# EAGLE board Linux_board.va (EAGLE 5.11)
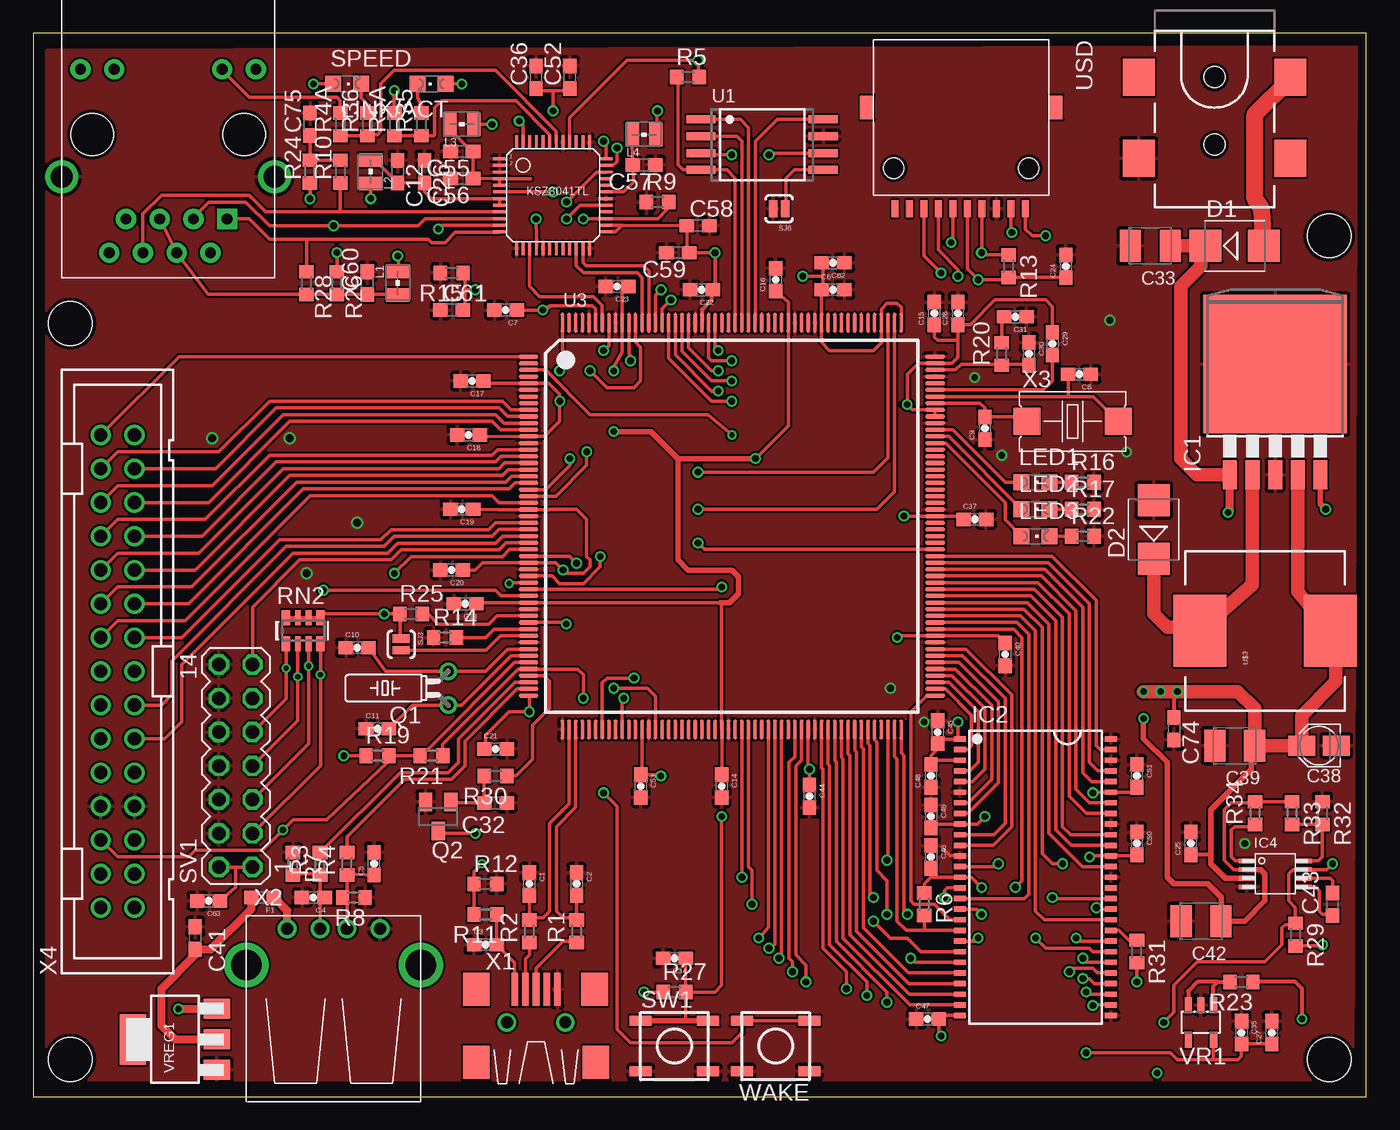
[diagram p3: board, top side]
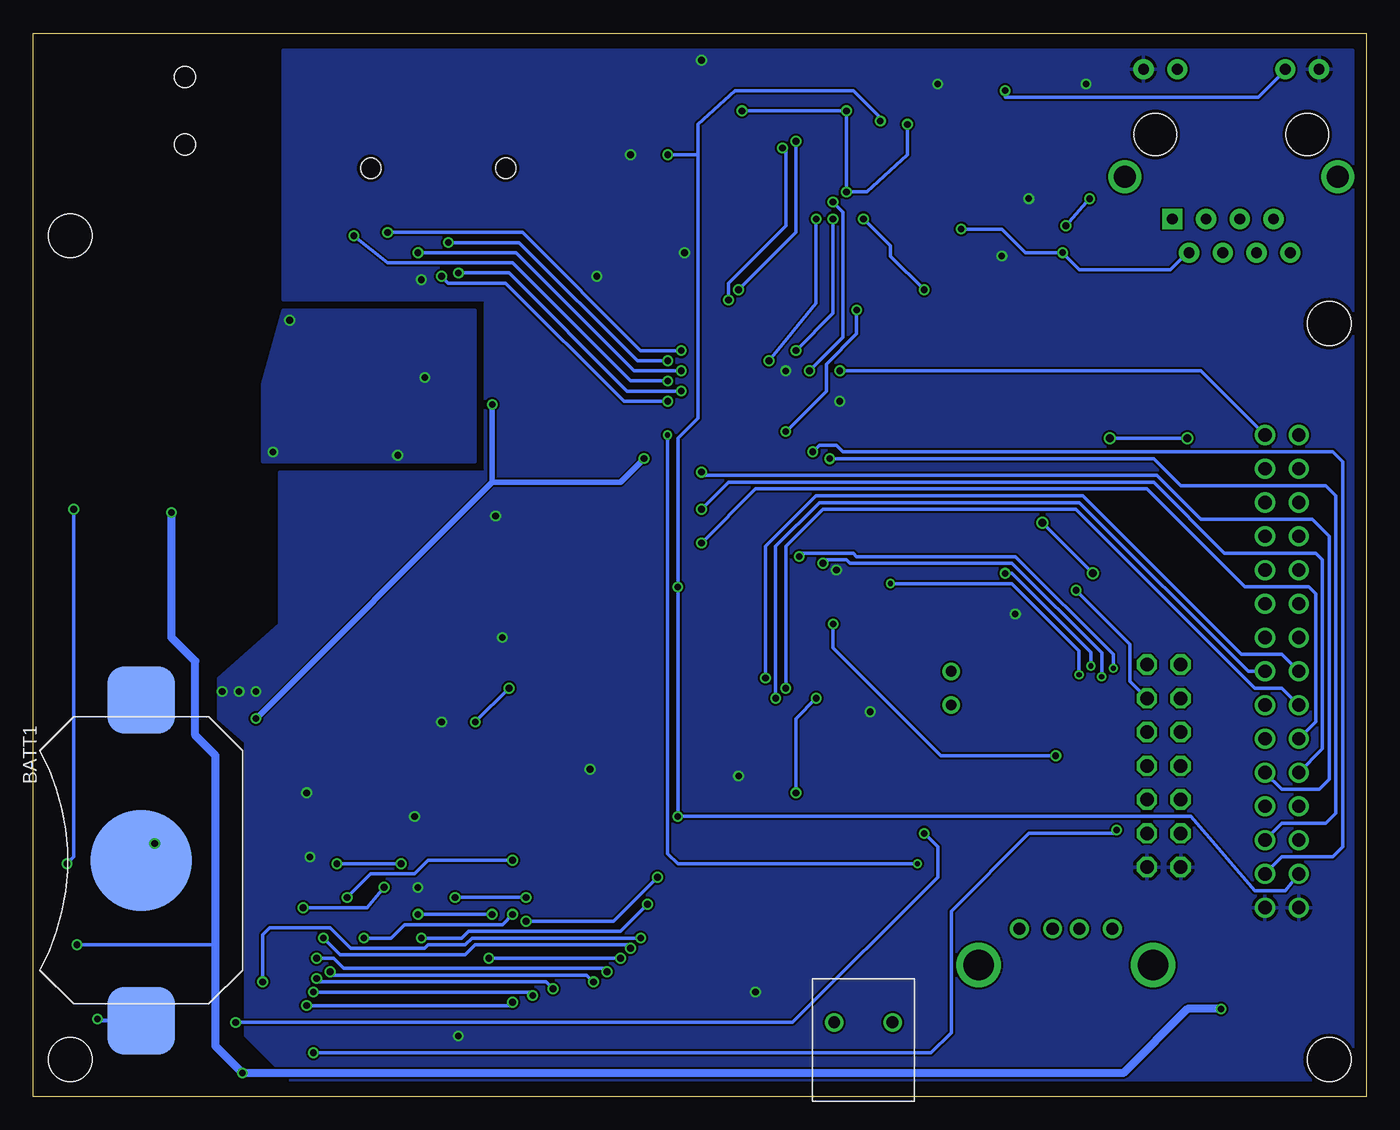
[diagram p4: board, bottom side, seen from below]

Size 100.33 x 80.01 mm. Coordinates in mm from the lower left corner, seen from the top.
Outline: 0,0 100.33,0 100.33,80.01 0,80.01 0,0
Copper layers (1*16): Top 0.035mm / dielectric 1.5mm / Bottom 0.035mm
Design rules "Fusion_eagle_rule_v1.1": minimum track width 6mil, minimum drill 12mil, track to track 6mil, track to pad 6mil, pad to pad 6mil, via to via 6mil, smd to smd 0mil, copper to edge 10mil, drill to drill 10mil, minimum pad ring 10mil, minimum via ring 6mil, stop-mask expansion 2mil, vias tented up to drill 100mil, thermal gap 10mil

## Footprints (pad centres in the part's own frame; a part is rotated, then mirrored left to right if it is on the bottom)
2032 = smd 5.08 x 5.08: V1 -12.065,0; V2 12.065,0 | smd 7.62 x 7.62: V- 0,0
0603-CAP = smd 1.1 x 1: 1 -0.85,0; 2 0.85,0
C0603 = smd 1.1 x 1: 1 -0.85,0; 2 0.85,0
C603 = smd 1.1 x 1: 1 -0.85,0; 2 0.85,0
SMC_B = smd 1.6 x 2.4: + -1.5,0; - 1.5,0
CASE_A = smd 2 x 1.5: + 1.3,0; - -1.3,0
SMB = smd 2.4 x 2.4: A 2.2,0; C -2.2,0
0603 = smd 1.1 x 1: 1 -0.85,0; 2 0.85,0
TO263-5 = smd 1.067 x 2.159: 1 -3.404,-5.791; 2 -1.702,-5.791; 3 0,-5.791; 4 1.702,-5.791; 5 3.404,-5.791 | smd 10.8 x 10.41: 6 0,2.54
TSOP54-400 = smd 0.4 x 0.9: 1 -10.4,-5.68; 2 -9.6,-5.68; 3 -8.8,-5.68; 4 -8,-5.68; 5 -7.2,-5.68; 6 -6.4,-5.68; 7 -5.6,-5.68; 8 -4.8,-5.68; 9 -4,-5.68; 10 -3.2,-5.68; 11 -2.4,-5.68; 12 -1.6,-5.68; 13 -0.8,-5.68; 14 0,-5.68; 15 0.8,-5.68; 16 1.6,-5.68; 17 2.4,-5.68; 18 3.2,-5.68; 19 4,-5.68; 20 4.8,-5.68; 21 5.6,-5.68; 22 6.4,-5.68; 23 7.2,-5.68; 24 8,-5.68; 25 8.8,-5.68; 26 9.6,-5.68; 27 10.4,-5.68; 28 10.4,5.68; 29 9.6,5.68; 30 8.8,5.68; 31 8,5.68; 32 7.2,5.68; 33 6.4,5.68; 34 5.6,5.68; 35 4.8,5.68; 36 4,5.68; 37 3.2,5.68; 38 2.4,5.68; 39 1.6,5.68; 40 0.8,5.68; 41 0,5.68; 42 -0.8,5.68; 43 -1.6,5.68; 44 -2.4,5.68; 45 -3.2,5.68; 46 -4,5.68; 47 -4.8,5.68; 48 -5.6,5.68; 49 -6.4,5.68; 50 -7.2,5.68; 51 -8,5.68; 52 -8.8,5.68; 53 -9.6,5.68; 54 -10.4,5.68
MSOP8 = smd 1.2 x 0.35: 1 -2.145,0.975; 2 -2.145,0.325; 3 -2.145,-0.325; 4 -2.145,-0.975; 5 2.145,-0.975; 6 2.145,-0.325; 7 2.145,0.325; 8 2.145,0.975
HR911105A = drill 0.813 pad 1.524 square: 1 4.445,-6.35 | drill 0.813 pad 1.524 round: 2 3.175,-8.89; 3 1.905,-6.35; 4 0.635,-8.89; 5 -0.635,-6.35; 6 -1.905,-8.89; 7 -3.175,-6.35; 8 -4.445,-8.89; 9 6.604,4.902; 10 4.064,4.902; 11 -4.064,4.902; 12 -6.604,4.902 | drill 1.651 pad 2.159 round: 13 8.001,-3.175; 14 -8.001,-3.175 | hole 3.2: 5.715,0; -5.715,0
STAND-OFF = hole 3.302: 0,0
WE-KI_0805_B = smd 1.02 x 1.78: 1 -0.89,0; 2 0.89,0
CHIPLED_0805 = smd 1.2 x 1.2: A 0,-1.05; C 0,1.05
TC26H = drill 0.813 round: 1 -1.27,0; 2 1.27,0
SOT23 = smd 1 x 1.4: 1 -0.95,-1.1; 2 0.95,-1.1; 3 0,1.1
R0603 = smd 1 x 1.1: 1 -0.85,0; 2 0.85,0
RN8P-4R-CRA06S = smd 0.63 x 1.15: 1 -1.295,-0.975; 4 1.295,-0.975; 5 1.295,0.975; 8 -1.295,0.975 | smd 0.44 x 1.15: 2 -0.4,-0.975; 3 0.4,-0.975; 6 0.4,0.975; 7 -0.4,0.975
SJ_2S-NO = smd 0.635 x 1.27: 1 -0.45,0; 2 0.45,0
MA07-2 = drill 1.016 octagon: 1 -7.62,-1.27; 2 -7.62,1.27; 3 -5.08,-1.27; 4 -5.08,1.27; 5 -2.54,-1.27; 6 -2.54,1.27; 7 0,-1.27; 8 0,1.27; 9 2.54,-1.27; 10 2.54,1.27; 11 5.08,-1.27; 12 5.08,1.27; 13 7.62,-1.27; 14 7.62,1.27
TACT_SWITCH_SMALL = smd 1.651 x 0.762: 1 -2.54,1.905; 2 2.54,1.905; 3 -2.54,-1.905; 4 2.54,-1.905
SO08W = smd 0.6 x 2.2: 1 -1.905,-4.6; 2 -0.635,-4.6; 3 0.635,-4.6; 4 1.905,-4.6; 5 1.905,4.6; 6 0.635,4.6; 7 -0.635,4.6; 8 -1.905,4.6
PQFP208 = smd 1.5 x 0.32: 1 -15.3,12.75; 2 -15.3,12.25; 3 -15.3,11.75; 4 -15.3,11.25; 5 -15.3,10.75; 6 -15.3,10.25; 7 -15.3,9.75; 8 -15.3,9.25; 9 -15.3,8.75; 10 -15.3,8.25; 11 -15.3,7.75; 12 -15.3,7.25; 13 -15.3,6.75; 14 -15.3,6.25; 15 -15.3,5.75; 16 -15.3,5.25; 17 -15.3,4.75; 18 -15.3,4.25; 19 -15.3,3.75; 20 -15.3,3.25; 21 -15.3,2.75; 22 -15.3,2.25; 23 -15.3,1.75; 24 -15.3,1.25; 25 -15.3,0.75; 26 -15.3,0.25; 27 -15.3,-0.25; 28 -15.3,-0.75; 29 -15.3,-1.25; 30 -15.3,-1.75; 31 -15.3,-2.25; 32 -15.3,-2.75; 33 -15.3,-3.25; 34 -15.3,-3.75; 35 -15.3,-4.25; 36 -15.3,-4.75; 37 -15.3,-5.25; 38 -15.3,-5.75; 39 -15.3,-6.25; 40 -15.3,-6.75; 41 -15.3,-7.25; 42 -15.3,-7.75; 43 -15.3,-8.25; 44 -15.3,-8.75; 45 -15.3,-9.25; 46 -15.3,-9.75; 47 -15.3,-10.25; 48 -15.3,-10.75; 49 -15.3,-11.25; 50 -15.3,-11.75; 51 -15.3,-12.25; 52 -15.3,-12.75; 105 15.3,-12.75; 106 15.3,-12.25; 107 15.3,-11.75; 108 15.3,-11.25; 109 15.3,-10.75; 110 15.3,-10.25; 111 15.3,-9.75; 112 15.3,-9.25; 113 15.3,-8.75; 114 15.3,-8.25; 115 15.3,-7.75; 116 15.3,-7.25; 117 15.3,-6.75; 118 15.3,-6.25; 119 15.3,-5.75; 120 15.3,-5.25; 121 15.3,-4.75; 122 15.3,-4.25; 123 15.3,-3.75; 124 15.3,-3.25; 125 15.3,-2.75; 126 15.3,-2.25; 127 15.3,-1.75; 128 15.3,-1.25; 129 15.3,-0.75; 130 15.3,-0.25; 131 15.3,0.25; 132 15.3,0.75; 133 15.3,1.25; 134 15.3,1.75; 135 15.3,2.25; 136 15.3,2.75; 137 15.3,3.25; 138 15.3,3.75; 139 15.3,4.25; 140 15.3,4.75; 141 15.3,5.25; 142 15.3,5.75; 143 15.3,6.25; 144 15.3,6.75; 145 15.3,7.25; 146 15.3,7.75; 147 15.3,8.25; 148 15.3,8.75; 149 15.3,9.25; 150 15.3,9.75; 151 15.3,10.25; 152 15.3,10.75; 153 15.3,11.25; 154 15.3,11.75; 155 15.3,12.25; 156 15.3,12.75 | smd 0.32 x 1.5: 53 -12.75,-15.3; 54 -12.25,-15.3; 55 -11.75,-15.3; 56 -11.25,-15.3; 57 -10.75,-15.3; 58 -10.25,-15.3; 59 -9.75,-15.3; 60 -9.25,-15.3; 61 -8.75,-15.3; 62 -8.25,-15.3; 63 -7.75,-15.3; 64 -7.25,-15.3; 65 -6.75,-15.3; 66 -6.25,-15.3; 67 -5.75,-15.3; 68 -5.25,-15.3; 69 -4.75,-15.3; 70 -4.25,-15.3; 71 -3.75,-15.3; 72 -3.25,-15.3; 73 -2.75,-15.3; 74 -2.25,-15.3; 75 -1.75,-15.3; 76 -1.25,-15.3; 77 -0.75,-15.3; 78 -0.25,-15.3; 79 0.25,-15.3; 80 0.75,-15.3; 81 1.25,-15.3; 82 1.75,-15.3; 83 2.25,-15.3; 84 2.75,-15.3; 85 3.25,-15.3; 86 3.75,-15.3; 87 4.25,-15.3; 88 4.75,-15.3; 89 5.25,-15.3; 90 5.75,-15.3; 91 6.25,-15.3; 92 6.75,-15.3; 93 7.25,-15.3; 94 7.75,-15.3; 95 8.25,-15.3; 96 8.75,-15.3; 97 9.25,-15.3; 98 9.75,-15.3; 99 10.25,-15.3; 100 10.75,-15.3; 101 11.25,-15.3; 102 11.75,-15.3; 103 12.25,-15.3; 104 12.75,-15.3; 157 12.75,15.3; 158 12.25,15.3; 159 11.75,15.3; 160 11.25,15.3; 161 10.75,15.3; 162 10.25,15.3; 163 9.75,15.3; 164 9.25,15.3; 165 8.75,15.3; 166 8.25,15.3; 167 7.75,15.3; 168 7.25,15.3; 169 6.75,15.3; 170 6.25,15.3; 171 5.75,15.3; 172 5.25,15.3; 173 4.75,15.3; 174 4.25,15.3; 175 3.75,15.3; 176 3.25,15.3; 177 2.75,15.3; 178 2.25,15.3; 179 1.75,15.3; 180 1.25,15.3; 181 0.75,15.3; 182 0.25,15.3; 183 -0.25,15.3; 184 -0.75,15.3; 185 -1.25,15.3; 186 -1.75,15.3; 187 -2.25,15.3; 188 -2.75,15.3; 189 -3.25,15.3; 190 -3.75,15.3; 191 -4.25,15.3; 192 -4.75,15.3; 193 -5.25,15.3; 194 -5.75,15.3; 195 -6.25,15.3; 196 -6.75,15.3; 197 -7.25,15.3; 198 -7.75,15.3; 199 -8.25,15.3; 200 -8.75,15.3; 201 -9.25,15.3; 202 -9.75,15.3; 203 -10.25,15.3; 204 -10.75,15.3; 205 -11.25,15.3; 206 -11.75,15.3; 207 -12.25,15.3; 208 -12.75,15.3
48PIN-TQFN = smd 1 x 0.22: P$1 -4,2.75; P$2 -4,2.25; P$3 -4,1.75; P$4 -4,1.25; P$5 -4,0.75; P$6 -4,0.25; P$7 -4,-0.25; P$8 -4,-0.75; P$9 -4,-1.25; P$10 -4,-1.75; P$11 -4,-2.25; P$12 -4,-2.75; P$25 4,-2.75; P$26 4,-2.25; P$27 4,-1.75; P$28 4,-1.25; P$29 4,-0.75; P$30 4,-0.25; P$31 4,0.25; P$32 4,0.75; P$33 4,1.25; P$34 4,1.75; P$35 4,2.25; P$36 4,2.75 | smd 0.22 x 1: P$13 -2.75,-4; P$14 -2.25,-4; P$15 -1.75,-4; P$16 -1.25,-4; P$17 -0.75,-4; P$18 -0.25,-4; P$19 0.25,-4; P$20 0.75,-4; P$21 1.25,-4; P$22 1.75,-4; P$23 2.25,-4; P$24 2.75,-4; P$37 2.75,4; P$38 2.25,4; P$39 1.75,4; P$40 1.25,4; P$41 0.75,4; P$42 0.25,4; P$43 -0.25,4; P$44 -0.75,4; P$45 -1.25,4; P$46 -1.75,4; P$47 -2.25,4; P$48 -2.75,4
POWER_JACK_SMD = smd 2.8 x 2.4: GND 0,-5.7; P$4 6.1,-5.7; VIN0 0,5.7; VIN1 6.1,5.7 | hole 1.6: 0,0; 5.08,0
CDRH125 = smd 5.4 x 4: 1 0,4.9; 2 0,-4.9
MICROSD = smd 1.27 x 0.508: 1 0,-7.645; 2 0,-6.553; 3 0,-5.461; 4 0,-4.369; 5 0,-3.277; 6 0,-2.184; 7 0,-1.092; 8 0,0; 9 0,-8.738; 10 0,-9.83 | smd 1.778 x 1.016: RSV1 -7.62,2.286; RSV2 -7.62,-11.938 | hole 1.524: -3.048,-9.906; -3.048,0.254
SOT-23-5 = smd 0.55 x 1.2: 1 -0.95,-1.3; 2 0,-1.3; 3 0.95,-1.3; 4 0.95,1.3; 5 -0.95,1.3
SOT223 = smd 1.5 x 2: 1 -2.3,-3.15; 2 0,-3.15; 3 2.3,-3.15 | smd 3.8 x 2: 4 0,3.15
USB-MB-S = smd 2.5 x 0.5: D+ 2.5,0; D- 2.5,0.8; GND 2.5,-1.6; ID 2.5,-0.8; VBUS 2.5,1.6 | smd 2.5 x 2: P$1 -3,-4.5; P$2 -3,4.5; P$3 2.5,-4.4; P$4 2.5,4.5 | drill 0.9 round: P$5 0,2.2; P$6 0,-2.2
USB-A-H = drill 0.914 round: D+ 2.718,-1.003; D- 2.718,1.003; GND 2.718,-3.493; VBUS 2.718,3.493 | drill 2.311 round: P$5 0,-6.566; P$6 0,6.566
5X8 = smd 2.032 x 2.032: 1 -3.429,0; 2 3.429,0
PAK100/2500-30 = drill 1 pad 1.422 round: 1 -17.78,-1.27; 2 -17.78,1.27; 3 -15.24,-1.27; 4 -15.24,1.27; 5 -12.7,-1.27; 6 -12.7,1.27; 7 -10.16,-1.27; 8 -10.16,1.27; 9 -7.62,-1.27; 10 -7.62,1.27; 11 -5.08,-1.27; 12 -5.08,1.27; 13 -2.54,-1.27; 14 -2.54,1.27; 15 0,-1.27; 16 0,1.27; 17 2.54,-1.27; 18 2.54,1.27; 19 5.08,-1.27; 20 5.08,1.27; 21 7.62,-1.27; 22 7.62,1.27; 23 10.16,-1.27; 24 10.16,1.27; 25 12.7,-1.27; 26 12.7,1.27; 27 15.24,-1.27; 28 15.24,1.27; 29 17.78,-1.27; 30 17.78,1.27

## Placement (x,y rotation side)
BATT1  BATT-2032  [2032]  92.2,17.78 270 bottom
C1  15p  [0603-CAP]  37.34,16 270 top
C2  15p  [0603-CAP]  40.89,16 270 top
C3  100n  [0603-CAP]  34.04,11.43 0 top
C4  47p  [0603-CAP]  21.08,14.99 180 top
C5  47p  [0603-CAP]  25.65,17.53 90 top
C6  0.1u  [0603-CAP]  60.2,60.71 0 top
C7  0.1u  [0603-CAP]  35.56,59.18 180 top
C8  10p  [0603-CAP]  78.74,54.36 180 top
C9  10p  [0603-CAP]  71.63,50.29 90 top
C10  10p  [0603-CAP]  24.38,33.78 0 top
C11  10p  [0603-CAP]  25.91,27.69 0 top
C12  0.1uF  [C0603]  27.43,69.6 270 top
C13  0.1u  [0603-CAP]  32.51,37.08 180 top
C14  0.1u  [0603-CAP]  51.82,23.37 270 top
C15  0.1u  [0603-CAP]  67.82,58.93 90 top
C16  0.1u  [0603-CAP]  55.88,61.47 90 top
C17  0.1u  [0603-CAP]  33.02,53.85 180 top
C18  0.1u  [0603-CAP]  32.77,49.78 180 top
C19  0.1u  [0603-CAP]  32.26,44.2 180 top
C20  0.1u  [0603-CAP]  31.5,39.62 180 top
C21  0.1u  [0603-CAP]  34.8,26.16 0 top
C22  0.1u  [0603-CAP]  50.29,60.71 180 top
C23  0.1u  [0603-CAP]  43.94,60.96 180 top
C24  0.1u  [0603-CAP]  77.72,62.48 90 top
C25  0.1u  [0603-CAP]  87.12,19.05 90 top
C26  22uF  [C0603]  29.46,69.6 270 top
C27  0.1u  [0603-CAP]  93.22,4.83 90 top
C28  0.1u  [0603-CAP]  69.6,58.93 90 top
C29  0.1u  [0603-CAP]  76.71,56.64 270 top
C30  1n  [0603-CAP]  74.93,55.88 270 top
C31  10n  [0603-CAP]  73.91,58.67 180 top
C32  0.1  [C603]  34.8,22.1 180 top
C33  220  [SMC_B]  84.07,64.01 180 top
C34  dnp  [0603-CAP]  48.26,10.41 180 top
C35  0.1u  [0603-CAP]  90.93,4.83 270 top
C36  0.1uF  [C0603]  37.85,76.71 90 top
C37  0.1u  [0603-CAP]  70.87,43.43 0 top
C38  [CASE_A]  96.77,26.42 180 top
C39  [SMC_B]  90.42,26.42 180 top
C40  0.1u  [0603-CAP]  73.15,33.27 270 top
C41  1  [C603]  12.19,11.94 270 top
C42  10u  [SMC_B]  87.88,13.21 180 top
C43  100n  [C603]  97.79,14.48 90 top
C44  0.1u  [0603-CAP]  58.42,22.61 270 top
C45  0.1u  [0603-CAP]  68.07,27.43 270 top
C46  0.1u  [0603-CAP]  67.56,18.03 270 top
C47  0.1u  [0603-CAP]  67.31,5.84 0 top
C48  0.1u  [0603-CAP]  67.56,24.13 90 top
C49  0.1u  [0603-CAP]  67.56,21.08 270 top
C50  0.1u  [0603-CAP]  83.06,19.05 270 top
C51  0.1u  [0603-CAP]  83.06,24.13 270 top
C52  22uF  [C0603]  40.39,76.71 90 top
C53  0.1u  [0603-CAP]  45.72,23.37 270 top
C55  0.1uF  [C0603]  32.26,71.12 180 top
C56  0.1uF  [C0603]  32.26,69.09 180 top
C57  0.1uF  [C0603]  45.97,70.1 180 top
C58  22uF  [C0603]  50.04,65.53 0 top
C59  0.1uF  [C0603]  48.51,63.5 180 top
C60  10uF  [C0603]  25.15,61.21 90 top
C61  100p  [C0603]  31.5,59.18 0 top
C62  0.1u  [0603-CAP]  60.2,62.74 180 top
C63  0.1u  [0603-CAP]  13.21,14.73 180 top
C74  0.1uF  [C0603]  85.85,27.69 270 top
C75  0.1uF  [C0603]  20.83,73.15 90 top
D1  [SMB]  90.42,64.01 0 top
D2  [SMB]  84.33,42.67 90 top
F1  PTC0603  [0603]  17.27,14.99 180 top
IC1  lm2596  [TO263-5]  93.47,52.58 0 top
IC2  MT48LC64M4A2  [TSOP54-400]  75.44,16.51 270 top
IC4  MCP1252-ADJ  [MSOP8]  93.47,16.76 0 top
J4  HR911105A  [HR911105A]  10.16,72.39 0 top
JP1  STAND-OFF  [STAND-OFF]  97.54,64.77 0 top
JP2  STAND-OFF  [STAND-OFF]  2.79,58.17 0 top
JP3  STAND-OFF  [STAND-OFF]  97.54,2.79 0 top
JP4  STAND-OFF  [STAND-OFF]  2.79,2.79 0 top
L1  [WE-KI_0805_B]  27.43,61.21 270 top
L2  [WE-KI_0805_B]  25.4,69.6 90 top
L3  [WE-KI_0805_B]  32.26,73.15 0 top
L4  [WE-KI_0805_B]  45.97,72.39 0 top
LED1  [CHIPLED_0805]  75.44,46.23 270 top
LED2  [CHIPLED_0805]  75.44,44.2 270 top
LED3  [CHIPLED_0805]  75.44,42.16 270 top
LINK/ACT  [CHIPLED_0805]  29.97,76.2 90 top
Q1  32768  [TC26H]  31.24,30.73 90 top
Q2  BSS123  [SOT23]  30.48,21.08 180 top
R1  39  [R0603]  40.89,12.45 90 top
R2  39  [R0603]  37.34,12.45 90 top
R3  39  [R0603]  21.59,17.53 90 top
R4  39  [R0603]  23.62,17.53 90 top
R4A  1K1  [R0603]  23.11,73.15 90 top
R5  100k  [R0603]  49.28,76.71 0 top
R5A  1K1  [R0603]  27.18,73.15 90 top
R6  100k  [R0603]  67.06,14.48 270 top
R7  15k  [R0603]  19.56,17.53 270 top
R8  15k  [R0603]  24.13,14.99 180 top
R9  10k  [R0603]  46.99,67.31 0 top
R10  49R9 1%  [R0603]  23.11,69.6 90 top
R11  27k  [R0603]  34.04,13.72 180 top
R12  47k  [R0603]  34.04,16 0 top
R13  100k  [R0603]  73.41,62.48 270 top
R14  1k  [R0603]  30.99,34.54 0 top
R15  6.49k  [R0603]  31.5,61.98 180 top
R16  1k  [R0603]  78.99,46.23 0 top
R17  1k  [R0603]  78.99,44.2 0 top
R19  100k  [R0603]  25.91,25.65 0 top
R20  1k  [R0603]  72.9,55.88 90 top
R21  100k  [R0603]  29.97,25.65 180 top
R22  1k  [R0603]  78.99,42.16 0 top
R23  1k  [R0603]  90.93,8.64 180 top
R24  49R9 1%  [R0603]  20.83,69.6 90 top
R25  1k  [R0603]  28.45,36.32 0 top
R26  49R9 1%  [R0603]  22.86,61.21 270 top
R27  dnp  [R0603]  48.26,7.87 0 top
R28  49R9 1%  [R0603]  20.57,61.21 270 top
R29  100k  [R0603]  95,12.19 270 top
R30  10k  [R0603]  34.8,24.13 180 top
R31  dnp  [R0603]  83.06,10.92 270 top
R32  15k  [R0603]  97.03,21.34 270 top
R33  7.4k  [R0603]  94.74,21.34 270 top
R34  100k  [R0603]  91.95,21.34 90 top
R35  1K1  [R0603]  29.21,73.15 90 top
R36  1K1  [R0603]  25.15,73.15 90 top
RN2  100k  [RN8P-4R-CRA06S]  20.32,35.05 0 top
SJ3  SOLDERJUMPERNO  [SJ_2S-NO]  27.69,34.04 270 top
SJ6  SOLDERJUMPERNO  [SJ_2S-NO]  56.13,66.8 180 top
SPEED  [CHIPLED_0805]  23.62,76.2 270 top
SV1  jtag  [MA07-2]  15.24,24.89 90 top
SW1  reset  [TACT_SWITCH_SMALL]  48.26,3.81 0 top
U1  AT45DB01XA  [SO08W]  54.86,71.63 270 top
U3  AT91SAM9260B-QU  [PQFP208]  52.58,42.93 0 top
U$1  KSZ8041TL  [48PIN-TQFN]  39.12,67.82 0 top
U$2  POWER_JACKSMD  [POWER_JACK_SMD]  88.9,76.71 270 top
U$3  [CDRH125]  92.71,35.05 90 top
USD  MICROSD  [MICROSD]  74.68,66.8 270 top
VR1  1.8  [SOT-23-5]  87.88,5.59 180 top
VREG1  5.0  [SOT223]  10.67,4.32 90 top
WAKE  [TACT_SWITCH_SMALL]  55.88,3.81 180 top
X1  USB-MB-S  [USB-MB-S]  37.85,5.59 90 top
X2  USB-A-H  [USB-A-H]  22.61,9.91 90 top
X3  OSC-XTAL28M_  [5X8]  78.23,50.8 0 top
X4  2530-  [PAK100/2500-30]  6.35,32 90 top

## Tracks (layer width: path | path; a pad name or v marks a point on that pad's centre or on a via)
1.8V  (via drill 0.5, 0.5 pad 0.25)
  Top 0.254: C16.1 56.83,59.79 U3.174 56.83,50.48 v54.36,48.01 | C13.1 33.53,37.08 33.69,37.18 U3.38 51.72,37.18 51.82,37.08 51.82,27.64 U3.77 C14.1 | U3.147 U3.148 66.18,51.68 v65.79,52.07 65.79,54.36 66.61,55.18 U3.155 69.15,55.18 69.6,55.63 69.6,56.9 | U3.203 42.33,59.27 42.08,59.52 38.95,59.52 v38.35,59.18 C7.1 | IC4.2 90.35,17.09 89.66,17.78 89.66,21.59 90.17,22.1 91.86,22.1 R34.2 R33.1 | C15.1 67.82,57.15 68.07,56.9 69.6,56.9 | 69.6,56.9 C28.1 70.52,58.08 72.39,59.94 76.2,59.94 76.71,59.44 C29.1
  Top 0.406: IC4.2 92.39,17.09 92.71,16.76 92.71,14.73 91.19,13.21 89.41,13.21 | 89.41,13.21 89.41,14.99 88.39,16 85.85,16 85.34,16.51 85.34,25.15 83.57,26.92 v83.57,28.45 | 89.41,13.21 89.41,12.95 | 48.51,48.01 v54.36,48.01 | 48.51,48.01 46.48,50.04 v43.69,50.04 | 51.72,37.18 52.42,37.18 53.09,37.85 53.09,39.12 52.58,39.62 49.28,39.62 48.51,40.39 48.51,48.01 | 89.41,13.21 C42.+
  Bottom 0.254: v43.69,50.04 40.64,53.09 40.64,55.12 38.35,57.4 v38.35,59.18
  Bottom 0.406: 65.79,46.23 v83.57,28.45 | 65.79,46.23 v65.79,52.07 | 65.79,46.23 56.13,46.23 v54.36,48.01
3.3V  (via drill 0.5, 0.51)
  Top 0.254: R5.2 v50.04,77.98 44.7,77.98 40.37,73.64 U$1.P$40 | U$1.P$26 44.33,65.57 | 44.33,65.57 C58.1 49.19,63.68 C59.1 v51.31,63.5 | C23.1 44.33,60.75 U3.199 44.33,56.01 43.69,54.86 v43.69,54.61 | C62.2 59.44,62.74 59.44,61.72 | 59.44,61.72 59.44,60.79 C6.1 59.33,60.69 U3.169 59.33,56.75 59.94,56.13 63.25,56.13 63.83,56.72 U3.160 63.83,59.26 64.26,59.69 65.02,59.69 65.33,59.39 U3.157 | 33.53,49.78 C18.1 33.76,49.64 33.93,49.64 U3.13 38.5,49.68 39.62,50.8 v39.62,52.32 39.62,52.83 38.78,53.68 U3.5 34.12,53.68 C17.1 | C19.1 33.53,44.2 35.03,44.18 U3.24 38.84,44.18 38.86,44.2 40.89,44.2 41.66,43.43 41.66,40.64 41.91,40.39 41.91,39.88 41.4,39.37 40.13,39.37 v39.88,39.62 39.33,40.18 U3.32 33.83,40.18 33.27,39.62 C20.1 | C21.1 34.04,26.25 34.04,27.18 35.81,28.96 v37.34,28.96 37.34,30.12 U3.52 | 15.24,17.27 SV1.2 | 15.24,17.27 SV1.1 | C37.1 70.02,43.68 U3.132 65.54,43.68 v65.53,43.69 | 45.83,24.22 U3.65 | C53.1 45.83,24.22 | RN2.8 RN2.7 RN2.6 RN2.5 21.66,36.32 v26.42,36.32 R25.1 27.6,34.29 27.69,34.29 SJ3.1 | 82.97,22.91 IC2.49 79.81,22.91 v79.76,22.86 | 82.97,22.91 C51.2 | IC2.27 68.43,6.11 C47.2 68.16,4.74 v68.33,4.57 | C49.2 67.59,20.51 IC2.9 71.06,20.51 v71.63,21.08 | C50.2 82.89,18.11 IC2.43 79.58,18.11 v79.5,18.03 | C63.1 15.24,15.75 15.24,17.27 | C40.1 72.6,34.68 U3.114 65.16,34.68 v65.02,34.54 | C44.1 v58.42,24.64 58.33,24.73 U3.90 | 82.97,22.91 83.06,22.82 | L1.1 27.56,62.1 v27.43,63.25 | v25.4,67.56 L2.1 | v69.6,28.19 69.6,27.07 IC2.1 68.07,26.91 68.07,26.67 | R27.1 v45.97,7.87 | 59.44,61.72 v57.91,61.72 | SPEED.A v21.08,76.2 | LINK/ACT.A v32.26,76.2 | USD.4 70.31,62.28 v71.12,61.47 73.24,61.47 R13.2 C24.1
  Top 0.254: U$1.P$25 43.83,65.07 44.33,65.57 | 45.83,24.22 47.16,24.22 v47.24,24.13 | 67.56,16.51 IC2.14 70.61,16.51 v71.37,15.75 | 67.56,16.51 C46.2 | 67.56,16.51 67.06,16 R6.1 | C45.2 68.07,26.16 67.56,25.65 C48.2 67.64,25.31 IC2.3 | U1.6 55.75,70.99 v55.37,70.87
  Top 0.305: v51.31,63.5 51.31,60.71 C22.1 51.05,60.62 51.05,59.94 50.33,59.22 U3.187 | C25.1 88.48,18.2 88.65,18.03 | C74.1 85.85,30.23 v86.11,30.48
  Top 0.406: IC4.3 89.73,16.44 88.65,17.53 88.65,18.03 88.65,21.59 91.69,24.64 91.69,26.19 C39.+ | C45.2 68.07,26.67
  Top 1.016: IC1.4 95.17,38 U$3.2 98.04,34.98 98.04,31.24 95.47,28.67 C38.+ C39.+ 91.95,26.44 91.95,29.21 90.68,30.48 v86.11,30.48 v83.57,30.48
  other vias: 84.84,30.48
  pour Bottom: 1.02,78.74 81.53,78.74 81.53,59.94 66.29,59.94 66.29,46.99 81.79,46.99 81.79,35.56 86.36,31.5 86.36,28.45 84.33,26.67 84.33,4.57 81.03,1.27 1.02,1.27
5V
  Top 0.61: F1.2 16.42,14.14 13.37,11.09 C41.2 12.19,10.67 9.65,8.13 9.65,5.33 10.67,4.32 VREG1.2
CCT
  Top 0.254: J4.5 J4.4 13.17,60.36 R28.2 R26.2 C60.1 27.65,60.36 L1.2
D0
  Top 0.254: IC2.2 70.31,26.11 70.61,26.42 70.61,28.7 68.64,30.68 U3.106
D1
  Top 0.254: IC2.4 70.48,24.51 71.12,25.15 71.12,28.96 68.9,31.18 U3.107
D2
  Top 0.254: IC2.5 70.7,23.71 71.63,24.64 71.63,29.21 69.16,31.68 U3.108
D3
  Top 0.254: IC2.7 70.37,22.11 72.14,23.88 72.14,29.46 69.42,32.18 U3.109
D4
  Top 0.254: IC2.8 70.33,21.31 72.64,23.62 72.64,29.72 69.69,32.68 U3.110
D5
  Top 0.254: IC2.10 72.29,19.71 73.15,20.57 73.15,29.97 69.95,33.18 U3.111
D6
  Top 0.254: IC2.11 72.25,18.91 73.66,20.32 73.66,30.23 70.21,33.68 U3.112
D7  (via drill 0.51)
  Top 0.254: U3.118 74.58,36.68 75.95,35.31 75.95,18.29 76.71,17.53 v77.47,17.53 | IC2.13 72.43,17.31 v72.64,17.53
  Bottom 0.254: v72.64,17.53 v77.47,17.53
D8
  Top 0.254: IC2.42 78.96,17.31 76.45,19.81 76.45,35.56 74.84,37.18 U3.119
D9
  Top 0.254: IC2.44 78.12,18.91 76.96,20.07 76.96,35.81 75.1,37.68 U3.120
D10
  Top 0.254: IC2.45 78.08,19.71 77.47,20.32 77.47,36.07 75.36,38.18 U3.121
D11
  Top 0.254: IC2.47 79.27,21.31 77.98,22.61 77.98,36.32 75.62,38.68 U3.122
D12
  Top 0.254: IC2.48 79.49,22.11 78.49,23.11 78.49,36.58 75.89,39.18 U3.123
D13
  Top 0.254: IC2.50 79.67,23.71 78.99,24.38 78.99,36.83 76.15,39.68 U3.124
D14
  Top 0.254: IC2.51 80.14,24.51 79.5,25.15 79.5,37.08 76.41,40.18 U3.125
D15
  Top 0.254: IC2.53 80.32,26.11 80.01,26.42 80.01,37.34 76.67,40.68 U3.126
GND  (via drill 0.5, 0.6)
  Top 0.254: IC2.12 69.01,18.11 68.58,18.54 | C45.1 68.07,28.19
  Bottom 0.254: v64.52,30.73 v67.06,28.19 | v13.46,49.53 v19.3,49.53 | v20.57,39.37 v24.38,43.18
  Bottom 0.406: BATT1.V- 89.92,17.78 v91.19,19.05
  other vias: 81.03,58.42 82.3,48.51 70.87,54.1 72.9,48.26
  pour Top (rank 6): 1.02,78.74 99.57,78.99 99.31,1.27 1.02,1.27
  pour Bottom: 67.06,59.18 67.06,47.75 83.06,47.75 83.06,53.59 81.53,59.18
LED_A
  Top 0.254: R5A.1 R35.1 30.14,72.3 30.23,72.39 30.23,74.42 30.73,74.93 36.32,74.93 38.87,72.39 U$1.P$43
LED_B
  Top 0.254: R4A.1 R36.1 25.23,72.39 25.91,72.39 26.16,72.64 26.16,76.2 27.18,77.22 34.8,77.22 39.37,72.65 U$1.P$42
LED_SPEED
  Top 0.254: J4.10 14.22,77.22 16.26,75.18 22.86,75.18 23.11,74.93 R4A.2
N$1  (via drill 0.38)
  Top 0.254: U3.35 35.88,38.68 v35.81,38.61 | SV1.3 21.61,24.92 v21.61,31.75 RN2.4
  Bottom 0.254: v21.61,31.75 21.61,33.55 26.67,38.61 v35.81,38.61
N$2
  Top 0.254: U3.45 35.71,33.68 34.04,32 Q1.2 26.5,32 C10.2
N$3
  Top 0.254: U3.46 35.97,33.18 32.26,29.46 Q1.1 28.54,29.46 C11.2
N$4
  Top 0.254: U3.149 71.27,52.18 71.63,51.82 C9.2 74.46,51.14 X3.1
N$5
  Top 0.254: U3.150 77.98,52.68 | 77.98,52.68 79.78,52.68 X3.2 | C8.2 77.89,52.76 77.98,52.68
N$6
  Top 0.254: U3.151 76.04,53.18 76.71,53.85 C29.2
N$7
  Top 0.254: IC2.18 68.99,13.31 67.82,14.48 66.29,14.48 66.04,14.73 66.04,28.96 67.26,30.18 U3.105
N$8  (via drill 0.51)
  Top 0.254: IC2.17 70.98,14.11 v71.37,13.72 | U3.104 65.33,25.86 65.53,25.65 65.53,13.97 v65.79,13.72
  Bottom 0.254: v65.79,13.72 v71.37,13.72
N$9
  Top 0.254: U3.116 74.05,35.68 74.93,34.8 74.93,15.24 74.6,14.91 IC2.16
N$10  (via drill 0.51)
  Top 0.254: U3.99 62.83,26.58 62.99,26.42 62.99,15.24 v63.25,14.99 | v68.58,14.99 68.58,15.49 68.8,15.71 IC2.15
  Bottom 0.254: v63.25,14.99 v68.58,14.99
N$11
  Top 0.254: IC2.23 65.87,9.31 62.48,12.7 62.48,26.16 62.33,26.32 U3.98
N$12
  Top 0.254: IC2.24 65.91,8.51 61.98,12.45 61.98,25.91 61.83,26.06 U3.97
N$29  (via drill 0.51)
  Top 0.254: U3.81 53.83,17.29 54.1,17.02 v54.1,14.48 | IC2.20 70.89,11.71 v71.12,11.94
  Bottom 0.254: v54.1,14.48 56.13,12.45 67.56,12.45 68.07,11.94 v71.12,11.94
N$30  (via drill 0.51)
  Top 0.254: IC2.21 66.81,10.91 65.79,11.94 64.52,11.94 v63.25,13.21 | U3.80 53.33,16.52 v53.34,16.51
  Bottom 0.254: v53.34,16.51 56.64,13.21 v63.25,13.21
N$31  (via drill 0.51)
  Top 0.254: U3.115 73.79,35.18 74.42,34.54 74.42,16.26 v73.91,15.75 | IC2.38 80.12,14.11 v80.01,14.22
  Bottom 0.254: v80.01,14.22 75.18,14.22 v73.91,15.75
N$32
  Top 0.254: IC2.25 65.95,7.71 61.47,12.19 61.47,25.65 61.33,25.79 U3.96
N$33
  Top 0.254: IC2.26 65.99,6.91 60.96,11.94 60.96,25.4 60.83,25.53 U3.95
N$34  (via drill 0.51)
  Top 0.254: U3.191 48.33,55.81 51.05,53.09 v51.56,53.09 | USD.1 67.03,63.27 v68.33,61.98
  Bottom 0.254: v51.56,53.09 55.63,53.09 64.52,61.98 v68.33,61.98
N$35
  Top 0.254: X2.D+ 23.61,14.66 R8.2 23.62,15.33 R4.1 23.62,16.76 C5.1
N$36
  Top 0.254: U3.51 36.43,30.68 32.51,26.76 32.51,24.89 31.5,23.88 27.94,23.88 23.62,19.56 R4.2
N$37
  Top 0.254: U3.43 35.18,34.68 34.09,33.59 SJ3.2
N$38
  Top 0.254: U3.50 36.26,31.18 32,26.92 32,25.15 31.24,24.38 27.6,24.38 R3.2
N$39
  Top 0.254: U3.181 53.33,71.36 53.34,71.88 52.96,72.26 U1.2
N$40  (via drill 0.5)
  Top 0.254: v97.79,17.53 97.35,17.09 IC4.7 94.81,17.09 94.49,16.76 94.49,14.73 95,14.22 R29.1 94.91,12.95 94.23,12.95 93.98,12.7 93.98,11.43 92.71,10.16 87.63,10.16 85.85,8.38 85.85,6.35 v85.09,5.59 | Q2.3 30.65,19.81 v33.27,19.81
  Top 0.406: IC1.5 96.88,44.6 v97.28,44.2
  Bottom 0.254: v97.28,44.2 97.28,18.03 v97.79,17.53 | v33.27,19.81 32.26,18.8 32.26,16.51 43.18,5.59 v85.09,5.59
N$41
  Top 0.254: U3.180 53.85,58.25 53.85,72.9 53.21,73.53 U1.1
N$42  (via drill 0.51)
  Top 0.254: C61.2 32.51,59.18 32.51,60.71 | 32.51,60.71 v33.27,60.71 | U$1.P$16 37.87,64.5 v37.85,66.04 | 32.51,60.71 32.51,61.89 R15.1
  Bottom 0.254: v33.27,60.71 35.81,63.25 35.81,64.01 v37.85,66.04
N$43
  Top 0.254: X4.18 6.35,35.81 11.43,35.81 20.83,45.21 34.54,45.21 35.08,44.68 U3.23
N$44
  Top 0.254: U3.26 34.79,43.18 34.29,42.67 26.92,42.67 26.16,41.91 18.54,41.91 11.18,34.54 X4.17
N$45
  Top 0.254: U3.179 54.36,58.25 54.36,71.88 56.01,73.53 U1.8
N$46
  Top 0.254: U3.9 35.95,51.68 35.31,52.32 17.78,52.32 13.97,48.51 6.35,48.51 X4.28
N$47  (via drill 0.5)
  Top 0.254: U3.37 35.22,37.68 34.8,38.1 v21.84,38.1
  Bottom 0.254: SV1.11 17.78,31.24 17.78,34.04 v21.84,38.1
N$48  (via drill 0.38, 0.51)
  Top 0.254: U3.30 35.84,41.18 35.31,40.64 28.45,40.64 v27.18,39.37 | RN2.3 v20.72,32.4 20.72,26.56 SV1.5
  Bottom 0.254: v20.72,32.4 20.72,33.42 26.67,39.37 v27.18,39.37
N$49  (via drill 0.38, 0.51)
  Top 0.254: U3.31 40.35,40.68 v40.89,40.13 | RN2.2 v19.92,31.6 19.92,28.3 SV1.7
  Bottom 0.254: v19.92,31.6 19.92,33.38 26.67,40.13 38.86,40.13 39.12,40.39 40.64,40.39 v40.89,40.13
N$50  (via drill 0.38, 0.51)
  Top 0.254: v42.67,40.64 42.67,39.88 41.4,38.61 39.62,38.61 39.06,39.18 U3.34 | RN2.1 v19.02,32.23 19.02,29.95 SV1.9
  Bottom 0.254: v42.67,40.64 42.42,40.89 38.61,40.89 38.35,40.64 26.39,40.64 19.02,33.27 v19.02,32.23
N$52
  Top 0.254: X4.13 9.65,29.46 10.41,30.23 10.41,32.77 19.05,41.4 26.42,41.4 27.18,42.16 34.54,42.16 35.06,42.68 U3.27
N$53  (via drill 0.51)
  Top 0.254: U3.94 60.33,25.27 60.45,25.15 60.45,11.68 64.26,7.87 v64.26,7.11 | IC2.29 79.81,6.91 v79.76,6.86
  Bottom 0.254: v64.26,7.11 64.52,6.86 v79.76,6.86
N$54  (via drill 0.51)
  Top 0.254: U3.93 59.83,25.01 59.94,24.89 59.94,11.43 62.74,8.64 v62.74,7.62 | IC2.30 79.41,7.71 v79.25,7.87
  Bottom 0.254: v62.74,7.62 62.99,7.87 v79.25,7.87
N$55  (via drill 0.51)
  Top 0.254: U3.92 59.33,24.75 59.44,24.64 59.44,11.18 61.21,9.4 v61.21,8.13 | IC2.31 79.88,8.51 79.5,8.89 v78.99,8.89
  Bottom 0.254: v61.21,8.13 61.72,8.64 78.74,8.64 v78.99,8.89
N$56  (via drill 0.51)
  Top 0.254: U3.89 57.83,25.32 57.4,24.89 57.4,10.67 58.17,9.91 v58.17,8.64 | IC2.32 80.1,9.31 79.76,9.65 78.23,9.65 v77.98,9.4
  Bottom 0.254: v58.17,8.64 58.67,9.14 77.72,9.14 v77.98,9.4
N$57  (via drill 0.51)
  Top 0.254: U3.88 57.33,25.58 56.9,25.15 56.9,10.41 57.15,10.16 v57.15,9.4 | IC2.33 79.3,10.11 v78.99,10.41
  Bottom 0.254: v57.15,9.4 57.4,9.65 76.96,9.65 77.72,10.41 v78.99,10.41
N$58  (via drill 0.51)
  Top 0.254: U3.100 63.33,26.84 63.5,26.67 63.5,17.02 64.26,16.26 v64.26,13.72 | IC2.34 79.77,10.91 79.5,11.18 76.2,11.18 v75.44,11.94
  Bottom 0.254: v64.26,13.72 65.02,12.95 72.39,12.95 73.41,11.94 v75.44,11.94
N$59  (via drill 0.51)
  Top 0.254: IC2.22 66.34,10.11 v66.04,10.41 | U3.86 56.33,10.61 v56.13,10.41
  Bottom 0.254: v56.13,10.41 v66.04,10.41
N$60  (via drill 0.51)
  Top 0.254: U3.85 55.83,11.48 v55.37,11.18 | IC2.35 78.71,11.71 v78.49,11.94
  Bottom 0.254: v55.37,11.18 55.63,11.43 67.06,11.43 67.82,10.67 77.22,10.67 v78.49,11.94
N$61  (via drill 0.51)
  Top 0.254: U3.84 55.33,12.74 v54.61,11.94 | v83.06,8.64 R31.2
  Bottom 0.254: v54.61,11.94 67.31,11.94 67.82,11.43 70.61,11.43 70.87,11.18 76.45,11.18 77.98,12.7 82.55,12.7 83.06,12.19 v83.06,8.64
N$62
  Top 0.254: R31.1 82.46,11.77 81.72,12.51 IC2.36
N$63  (via drill 0.5)
  Top 0.254: R19.1 v23.37,25.65 | U3.41 40.02,35.68 v40.13,35.56
  Bottom 0.254: v23.37,25.65 32,25.65 40.13,33.78 v40.13,35.56
N$64
  Top 0.254: U3.182 52.83,69.09 52.2,69.72 U1.4 48.9,69.72 48.51,70.1 48.51,76.62 R5.1
N$65
  Top 0.254: X4.11 9.91,26.92 11.18,28.19 11.18,32.51 19.56,40.89 26.67,40.89 27.43,41.66 34.8,41.66 35.32,42.18 U3.28
N$66
  Top 0.254: R10.2 R24.2 C75.1
N$67
  Top 0.254: U$1.P$8 U$1.P$7 29.97,67.57 29.46,68.07 C26.2 C12.2 25.65,70.52 L2.2
N$68
  Top 0.254: Q2.1 31.51,22.1 C32.2 R30.2
N$69
  Top 0.254: U$1.P$15 37.37,63.22 37.34,60.96 38.1,60.2 42.16,60.2 42.83,59.53 U3.202
N$70  (via drill 0.51)
  Top 0.254: R9.2 47.75,66.8 47.02,66.07 U$1.P$27 41.43,66.07 v41.4,66.04 | U3.198 44.83,56.01 v44.96,55.37
  Bottom 0.254: v44.96,55.37 41.4,59.69 v41.4,66.04
N$71  (via drill 0.51)
  Top 0.254: U3.102 64.33,17.85 v64.26,17.78 | IC2.39 76.78,14.91 v76.71,14.99
  Bottom 0.254: v64.26,17.78 70.61,17.78 71.63,16.76 74.93,16.76 v76.71,14.99
N$72
  Top 0.254: U3.195 46.33,62.13 45.94,62.52 41.62,62.52 41.37,62.77 U$1.P$23
N$73
  Top 0.254: U$1.P$22 40.87,62.51 41.4,61.98 45.47,61.98 45.83,61.61 U3.196
N$74  (via drill 0.51)
  Top 0.254: U$1.P$29 41.16,67.07 v40.13,66.04 | U3.201 43.33,56.49 v42.93,56.13
  Bottom 0.254: v40.13,66.04 40.13,58.93 v42.93,56.13
N$75
  Top 0.254: U1.5 57.28,69.72 56.64,69.09 56.64,66.86 SJ6.1
N$76  (via drill 0.51)
  Top 0.254: U$1.P$34 42.39,69.57 v40.13,67.31 | v41.91,54.61 43.18,53.34 45.21,53.34 45.72,53.85 45.72,56.39 45.33,56.78 U3.197
  Bottom 0.254: v41.91,54.61 39.37,57.15 39.37,66.55 v40.13,67.31
N$77  (via drill 0.51)
  Top 0.254: U3.193 47.33,59.27 v48.01,59.94 | v43.94,71.37 43.94,70.36 43.65,70.07 U$1.P$35
  Bottom 0.254: v48.01,59.94 48.01,61.21 43.69,65.53 43.69,71.12 v43.94,71.37
N$78  (via drill 0.51)
  Top 0.254: U$1.P$36 43.12,71.69 v42.93,71.88 | U3.194 46.83,60.29 v47.24,60.71
  Bottom 0.254: v47.24,60.71 42.93,65.02 v42.93,71.88
N$79
  Top 0.254: U3.40 34.91,36.18 34.29,35.56 30.48,35.56 29.72,36.32 R25.2
N$80
  Top 0.254: U3.143 68.68,49.18 73.15,44.7 73.15,43.4 LED3.A
N$81
  Top 0.254: R36.2 25.15,74.68 24.67,75.15 SPEED.C
N$82
  Top 0.254: U3.10 35.69,51.18 35.05,51.82 18.29,51.82 13.72,47.24 X4.27
N$83
  Top 0.254: R14.2 34.04,34.54 34.67,35.18 U3.42
N$84
  Top 0.254: U3.103 64.83,25.6 65.02,25.4 65.02,13.21 65.72,12.51 67.06,12.51 | 67.06,12.51 IC2.19 | 67.06,12.51 R6.2
N$85
  Top 0.254: U3.117 74.31,36.18 75.44,35.05 75.44,13.97 76.1,13.31 IC2.37
N$86
  Top 0.254: U$1.P$5 U$1.P$4 37.43,69.07 C56.1 C55.1 32.51,71.63 31.75,72.39 31.75,72.77 L3.1
N$87
  Top 0.254: L4.1 C57.2 45.21,68.83 44.45,68.07 U$1.P$31
N$88
  Top 0.254: R35.2 29.21,74.68 28.92,75.15 LINK/ACT.C
N$89  (via drill 0.51)
  Top 0.254: U$1.P$6 38.61,68.07 v39.12,68.07 | C52.1 40.39,75.69 39.12,75.69 | 37.85,75.69 C36.1 38.01,75.69 39.12,75.69 | v34.54,73.15 L3.2 | L4.2 46.86,72.26 v46.99,74.17 | v39.12,74.17 39.12,75.69
  Bottom 0.254: v46.99,74.17 v39.12,74.17 v39.12,68.07 37.84,68.07 37.59,68.07 34.54,70.86 v34.54,73.15
N$90
  Top 0.254: U3.144 68.91,49.68 LED2.A
N$91
  Top 0.305: VR1.3 86.93,7.94 87.63,8.64 89.15,8.64 | 89.15,8.64 R23.2 | VR1.1 88.83,8.32 89.15,8.64
N$92  (via drill 0.51)
  Top 0.254: v27.18,75.69 R5A.2
  Bottom 0.254: J4.11 6.1,77.22 8.13,75.18 27.18,75.18 v27.18,75.69
N$94
  Top 0.254: U3.145 69.2,50.18 73.15,46.23 LED1.A
N$95
  Top 0.254: R16.1 LED1.C
N$96
  Top 0.254: U3.54 40.33,22.04 38.86,20.57 38.86,13.97 38.35,13.46 37.5,13.46 R2.2 C1.2
N$97
  Top 0.254: R1.2 41.06,13.3 | U3.55 40.83,21.78 39.37,20.32 39.37,13.97 39.88,13.46 40.81,13.46 R1.2 | R1.2 C2.2
N$98
  Top 0.254: R17.1 LED2.C
N$99
  Top 0.254: X1.D- 37.05,10.38 37.34,10.67 R2.1
N$100
  Top 0.254: X1.D+ 37.85,9.65 39.88,11.68 40.81,11.68 R1.1
N$101
  Top 0.254: R22.1 LED3.C
N$102
  Top 0.254: X1.VBUS 36.25,10.07 C3.2 R11.1
N$103
  Top 0.254: U3.11 35.43,50.68 34.8,51.31 18.8,51.31 13.46,45.97 6.35,45.97 X4.26
N$104
  Top 0.254: X4.25 13.21,44.7 19.3,50.8 34.54,50.8 35.17,50.18 U3.12
N$106  (via drill 0.5)
  Top 0.305: v95.5,5.84 95.5,8.13 95,8.64 R23.1
  Bottom 0.305: BATT1.V2 95.25,5.71 v95.5,5.84
N$107  (via drill 0.51)
  Top 0.254: U3.190 48.83,56.07 51.05,53.85 v52.58,53.85 | USD.8 74.68,65.28 75.18,64.77 v76.2,64.77
  Bottom 0.254: v52.58,53.85 55.37,53.85 64.26,62.74 73.66,62.74 v76.2,64.77
N$108
  Top 0.254: X4.24 6.35,43.43 12.95,43.43 17.78,48.26 34.54,48.26 34.96,48.68 U3.15
N$109
  Top 0.254: U3.16 35.22,48.18 34.8,47.75 18.29,47.75 12.7,42.16 X4.23
N$110
  Top 0.254: X4.22 6.35,40.89 12.45,40.89 18.8,47.24 35.05,47.24 35.48,47.68 U3.17
N$111
  Top 0.254: U3.18 35.75,47.18 35.31,46.74 19.3,46.74 12.19,39.62 X4.21
N$112
  Top 0.254: X4.20 6.35,38.35 11.94,38.35 19.81,46.23 35.56,46.23 36.01,46.68 U3.19
N$113
  Top 0.254: X4.19 11.68,37.08 20.32,45.72 35.81,45.72 36.27,46.18 U3.20
N$114  (via drill 0.51)
  Top 0.254: U3.158 64.83,45.52 63.5,44.2 v50.04,44.2
  Bottom 0.254: X4.10 3.3,26.16 3.3,40.39 3.81,40.89 10.67,40.89 16,46.23 48.01,46.23 v50.04,44.2
N$115  (via drill 0.51)
  Top 0.254: U3.159 64.33,48.07 63.25,46.99 v50.04,46.99
  Bottom 0.254: X4.9 6.35,23.11 3.56,23.11 2.79,23.88 2.79,42.16 4.06,43.43 12.45,43.43 15.75,46.74 40.13,46.74 49.78,46.74 v50.04,46.99
N$116  (via drill 0.51)
  Top 0.254: U3.21 38.56,45.68 40.39,47.5 v40.39,48.01
  Bottom 0.254: X4.5 6.35,20.57 3.05,20.57 2.29,21.34 2.29,45.21 3.05,45.97 13.97,45.97 16,48.01 v40.39,48.01
N$117  (via drill 0.51)
  Top 0.254: U3.22 39.33,45.18 41.66,47.5 v41.66,48.51
  Bottom 0.254: X4.3 6.35,18.03 2.54,18.03 1.78,18.8 1.78,47.75 2.54,48.51 39.37,48.51 39.88,49.02 41.15,49.02 v41.66,48.51
N$118  (via drill 0.51)
  Top 0.254: U3.62 44.33,29.84 v44.45,29.97
  Bottom 0.254: X4.15 8.89,32 21.59,44.7 41.15,44.7 44.45,41.4 v44.45,29.97
N$119
  Top 0.254: R20.2 72.9,58.51 C31.2
N$120
  Top 0.254: U3.154 69.41,54.68 69.85,55.12 72.9,55.12 | 72.81,55.12 R20.1 72.9,55.12 | 72.9,55.12 74.84,55.12 C30.2
N$121
  Top 0.61: X2.VBUS 19.11,13.99 F1.1
N$122  (via drill 0.51)
  Top 0.254: v43.69,30.73 46.23,30.73 46.83,30.13 U3.67
  Bottom 0.254: X4.14 6.35,30.73 8.38,30.73 21.84,44.2 40.89,44.2 43.69,41.4 v43.69,30.73
N$123  (via drill 0.51)
  Top 0.254: v45.21,31.5 43.18,31.5 42.83,31.14 U3.59
  Bottom 0.254: X4.16 6.35,33.27 9.4,33.27 21.34,45.21 41.4,45.21 45.21,41.4 v45.21,31.5
N$124  (via drill 0.51)
  Top 0.254: U3.127 50.52,41.18 v50.04,41.66
  Bottom 0.254: X4.12 3.81,28.19 3.81,37.85 4.32,38.35 9.14,38.35 16.51,45.72 45.97,45.72 v50.04,41.66
N$125
  Top 0.254: U3.29 35.58,41.68 35.05,41.15 27.69,41.15 26.92,40.39 20.07,40.39 16.51,36.83 SV1.13
N$126
  Top 1.27: U$2.VIN0 94.6,76.57 91.95,73.91 91.95,67.56 92.46,66.8 D1.A
N$127
  Top 1.016: IC1.2 91.77,38.5 U$3.1 88.06,35.31 85.34,35.31 84.33,36.32 D2.C
N$130
  Top 0.254: IC4.6 97.61,16.44 97.79,16.26 C43.2
N$131
  Top 0.254: IC4.5 96.48,15.79 96.77,15.49 96.77,13.97 97.03,13.72 97.7,13.72 C43.1
N$132
  Top 0.254: R33.2 R32.2 97.03,18.03 96.73,17.74 IC4.8
N$134
  Top 0.254: IC4.1 90.47,17.74 90.17,18.03 90.17,20.07 90.42,20.32 91.78,20.32 R34.1
N$164  (via drill 0.5)
  Top 0.254: WAKE.3 WAKE.4 53.34,4.83 52.58,4.06 44.96,4.06 43.94,5.08 43.94,21.84 v42.93,22.86 | v41.4,29.97 41.4,31.75 40.98,32.18 U3.48 36.49,32.18 30.82,26.5 R21.1
  Bottom 0.254: v41.4,29.97 42.93,28.45 v42.93,22.86
NRST  (via drill 0.51)
  Top 0.254: U$1.P$47 36.87,73.12 v36.58,73.41 | R27.2 C34.1 | R27.2 49.11,5.71 | v51.82,21.08 51.82,8.38 51.31,7.87 R27.2 | U1.3 50.65,70.87 v52.58,70.87 | U3.36 51.64,38.18 v51.82,38.35
  Top 0.406: SW1.1 49.11,5.71 SW1.2
  Bottom 0.254: 50.29,70.87 v52.58,70.87 | 50.29,70.87 50.29,51.05 51.82,49.53 v51.82,38.35 v51.82,21.08 13.21,21.08 8.38,15.49 6.1,15.49 X4.4 | v36.58,73.41 36.58,73.66 38.61,75.69 47.5,75.69 50.29,73.15 50.29,70.87
RD+  (via drill 0.51)
  Top 0.254: J4.3 12.06,66.17 13.21,67.31 16,67.31 17.78,65.53 v22.61,65.53 28.96,65.53 29.49,66.07 U$1.P$10 | v20.83,67.56 R24.1
  Bottom 0.254: v22.61,65.53 v20.83,67.56
RD-
  Top 0.254: J4.6 8.26,66.42 9.65,67.82 16.26,67.82 17.51,66.57 23.11,66.57 | 23.11,66.57 U$1.P$9 | 23.11,66.57 R10.1
SDCLK  (via drill 0.51)
  Top 0.254: U3.189 49.33,56.34 51.05,54.61 v51.56,54.61 | USD.5 71.4,64.29 v71.37,63.5 71.54,63.33 R13.1
  Bottom 0.254: v51.56,54.61 55.12,54.61 64.01,63.5 v71.37,63.5
SDCS  (via drill 0.51)
  Top 0.254: U3.192 47.83,55.55 51.05,52.32 v52.58,52.32 | USD.2 68.12,63.7 69.6,62.23 v69.6,61.72
  Bottom 0.254: v52.58,52.32 55.88,52.32 64.77,61.21 69.09,61.21 v69.6,61.72
SDMISO  (via drill 0.51)
  Top 0.254: U3.185 51.33,56.37 v51.56,56.13 | USD.7 73.58,65.1 v73.66,65.02
  Bottom 0.254: v51.56,56.13 54.61,56.13 63.5,65.02 v73.66,65.02
SDMOSI  (via drill 0.51)
  Top 0.254: U3.186 50.83,55.6 51.05,55.37 v52.58,55.37 | USD.3 69.22,64.39 v69.09,64.26
  Bottom 0.254: v52.58,55.37 54.86,55.37 63.75,64.26 v69.09,64.26
SHDN
  Top 0.254: R30.1 36.32,24.13 37.59,25.4 37.59,27.94 38.86,29.21 38.86,31.24 38.43,31.68 U3.49
TD+
  Top 0.254: J4.1 16.26,66.04 17.78,64.52 20.57,64.52 | 20.57,64.52 29.72,64.52 29.97,64.26 30.99,64.26 31.75,65.02 35.07,65.02 U$1.P$12 | 20.57,64.52 R28.1
TD-  (via drill 0.5)
  Top 0.254: v22.86,63.5 R26.1 | U$1.P$11 30.77,65.57 v30.48,65.28
  Bottom 0.254: J4.2 13.46,63.5 14.73,62.23 21.59,62.23 v22.86,63.5 25.65,63.5 27.43,65.28 v30.48,65.28
TWCK
  Top 0.254: U3.1 10.97,55.68 X4.30
TWD  (via drill 0.51)
  Top 0.254: U3.208 39.83,54.81 v39.62,54.61
  Bottom 0.254: X4.29 12.45,54.61 v39.62,54.61
USB_D-
  Top 0.254: X2.D- 21.6,14.66 C4.1 21.59,15.33 R3.1 21.59,16.76 19.65,16.76 R7.2
USBDETECT  (via drill 0.38)
  Top 0.254: U3.3 38.54,54.68 41.91,51.31 50.8,51.31 v52.58,49.78 | R11.2 R12.1 33.19,16.93 v33.78,17.53
  Bottom 0.254: v52.58,49.78 52.58,18.29 51.82,17.53 v33.78,17.53
VDDBU  (via drill 0.5)
  Top 0.254: X4.6 6.35,18.03 11.68,18.03 12.19,18.54 17.27,18.54 v18.8,20.07 19.56,20.83 22.1,20.83 26.67,25.15 26.67,25.65 R19.2 R21.2 | R21.2 29.21,25.65 29.21,25.74 R21.2 | R21.2 29.63,26.07 36.23,32.68 U3.47 | C27.1 C35.2 90.93,3.05 90.68,2.79 88.83,2.79 | 88.83,3.62 VR1.5 88.83,2.79 | v79.25,3.3 85.6,3.3 86.11,2.79 88.83,2.79
  Bottom 0.254: v79.25,3.3 32.77,3.3 31.24,4.83 31.24,13.97 25.4,19.81 19.05,19.81 v18.8,20.07
VIN  (via drill 0.5)
  Top 0.254: R29.2 96.94,11.34 v97.03,11.43
  Top 0.406: VREG1.3 10.92,6.62 v10.92,6.6
  Top 0.61: IC1.1 90.07,44.09 v89.92,43.94 | v10.92,6.6 12.95,6.6
  Top 1.016: C33.+ D1.C 87.88,63.67 87.88,62.48 86.36,60.96 86.36,48.01 87.58,46.79 IC1.1
  Bottom 0.254: 86.61,11.43 v97.03,11.43
  Bottom 0.61: v10.92,6.6 13.46,6.6 18.29,1.78 v84.58,1.78 86.61,3.81 86.61,11.43 86.61,25.65 88.14,27.18 88.14,32.77 89.92,34.54 v89.92,43.94